# EAGLE schematic zigbee (EAGLE 6.3)
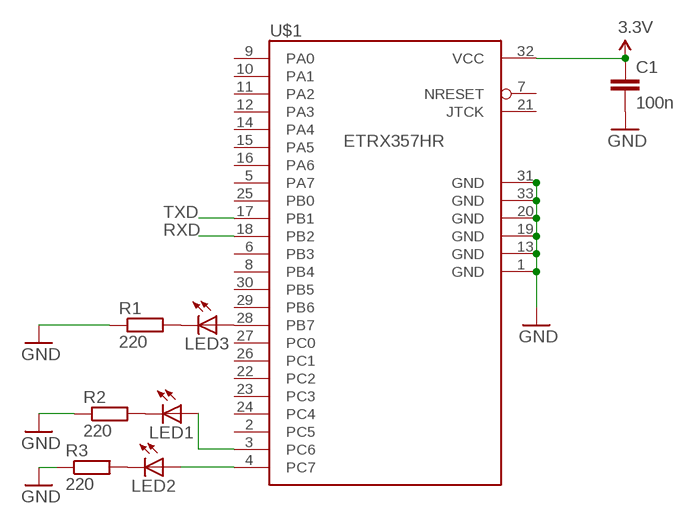
[diagram p0: schematic, sheet 1]

## Parts
C1  100n  C-EUC0805  [C0805]
LED1  LED1206  [LED-1206]
LED2  LED1206  [LED-1206]
LED3  LED1206  [LED-1206]
R1  220  R-EU_M0805  [M0805]
R2  220  R-EU_M0805  [M0805]
R3  220  R-EU_M0805  [M0805]
U$1  ETRX357HR  [ETRX3]

## Nets
3.3V: C1.1 U$1.32(VCC)
GND: C1.2 R1.1 R2.1 R3.1 U$1.1(GND) U$1.13(GND) U$1.19(GND) U$1.20(GND) U$1.31(GND) U$1.33(GND)
N$1: LED1.A U$1.3(PC6)
N$2: LED2.A U$1.4(PC7)
N$3: LED3.A U$1.28(PB7)
N$4: LED3.C R1.2
N$5: LED1.C R2.2
N$6: LED2.C R3.2
RXD: U$1.18(PB2)
TXD: U$1.17(PB1)
Unconnected: U$1.2(PC5) U$1.5(PA7) U$1.6(PB3) U$1.7(NRESET) U$1.8(PB4) U$1.9(PA0) U$1.10(PA1) U$1.11(PA2) U$1.12(PA3) U$1.14(PA4) U$1.15(PA5) U$1.16(PA6) U$1.21(JTCK) U$1.22(PC2) U$1.23(PC3) U$1.24(PC4) U$1.25(PB0) U$1.26(PC1) U$1.27(PC0) U$1.29(PB6) U$1.30(PB5)

## Library data of the parts
C1 = rcl:C-EU: CAPACITOR, European symbol
LED1-LED3 = SparkFun-LED (1):LED: LEDs Standard schematic elements and footprints for 5mm, 3mm, 1206, and 0603 sized LEDs. 5mm - Spark Fun Electronics SKU : COM-00529 (and others)
R1-R3 = rcl:R-EU_: RESISTOR, European symbol
U$1 = etrx357_logical:ETRX357*: ETRX357 or ETRX351. Pins arranged logically